# Altium schematic sheet 协调器_wifi_oled.SchDoc
size A
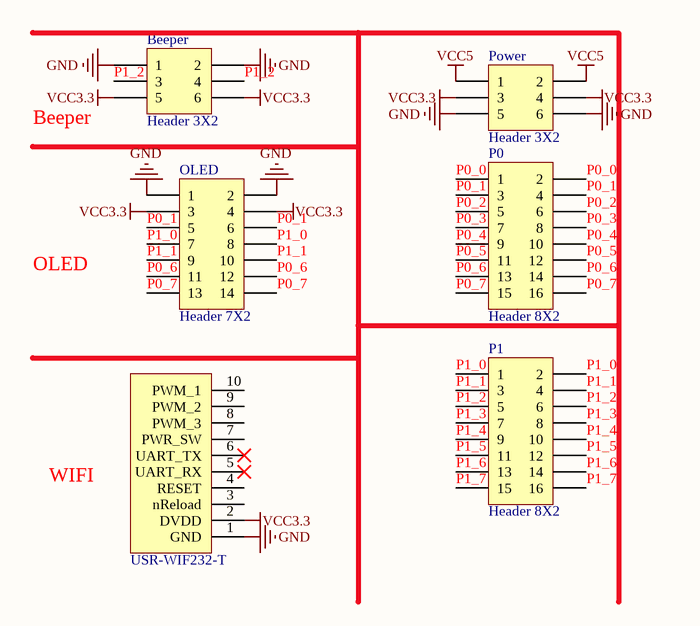
[diagram p0: 协调器_wifi_oled.SchDoc]

## Parts
?  USR-WIF232-T  [USR-WIFI232-T]
Beeper  Header 3X2  [HDR2X3]
OLED  Header 7X2  [HDR2X7]
P0  Header 8X2  [HDR2X8]
P1  Header 8X2  [HDR2X8]
Power  Header 3X2  [HDR2X3]

## Nets
GND: ?.1(GND) Beeper.1 Beeper.2 OLED.1 OLED.2 Power.5 Power.6
VCC3.3: ?.2(DVDD) Beeper.5 Beeper.6 OLED.3 OLED.4 Power.3 Power.4
VCC5: Power.1 Power.2
P0_0: P0.1 P0.2
P0_1: OLED.5 OLED.6 P0.3 P0.4
P0_2: P0.5 P0.6
P0_3: P0.7 P0.8
P0_4: P0.9 P0.10
P0_5: P0.11 P0.12
P0_6: OLED.11 OLED.12 P0.13 P0.14
P0_7: OLED.13 OLED.14 P0.15 P0.16
P1_0: OLED.7 OLED.8 P1.1 P1.2
P1_1: OLED.9 OLED.10 P1.3 P1.4
P1_2: Beeper.3 Beeper.4 P1.5 P1.6
P1_3: P1.7 P1.8
P1_4: P1.9 P1.10
P1_5: P1.11 P1.12
P1_6: P1.13 P1.14
P1_7: P1.15 P1.16

Not connected (* = marked no-connect by the designer): ? 3(nReload) 4(RESET) 5(UART_RX)* 6(UART_TX)* 7(PWR_SW) 8(PWM_3) 9(PWM_2) 10(PWM_1)

## Notes on the sheet
- (near Beeper) Beeper
- OLED
- WIFI

## Library data of the parts
Beeper Power = Header 3X2: Header, 3-Pin, Dual row; LatestRevisionDate: 17-Jul-2002; LatestRevisionNote: Re-released for DXP Platform.; Publisher: Altium Limited
OLED = Header 7X2: Header, 7-Pin, Dual row; LatestRevisionDate: 17-Jul-2002; LatestRevisionNote: Re-released for DXP Platform.; Publisher: Altium Limited
P0 P1 = Header 8X2: Header, 8-Pin, Dual row; LatestRevisionDate: 17-Jul-2002; LatestRevisionNote: Re-released for DXP Platform.; Publisher: Altium Limited